# Altium schematic sheet Mode.SchDoc: Наименование
size 420 x 297 mm; ApprovedBy: Утвердил; CheckedBy: Проверил; Author: Разработал; CompanyName: ВлГУ; DrawnBy: Н.Контр; Engineer: Т.Контр; SheetNumber: 2; SheetTotal: 1; PageSetup: Record=PageOptions|CenterHorizontal=True|CenterVertical=True|PrintScale=0.94|XCorrection=1.00|YCorrection=1.00|PrintKind=1|BorderSize=5000000|LeftOffset=0|BottomOffset=0|Orientation=1|PaperLength=1000|PaperWidth=1000|Scale=100|PaperSource=7|PrintQuality=-4|MediaType=1|DitherType=10|PaperKind=A4|PrintScaleMode=1; DecimalNumber: СНАБ.468222.001 ЭЗ; HeadOfSector: Нач. сектора; MainDevice: Перв.примен.; Name: Наименование; DocumentName: Sheet1.SCHDOC
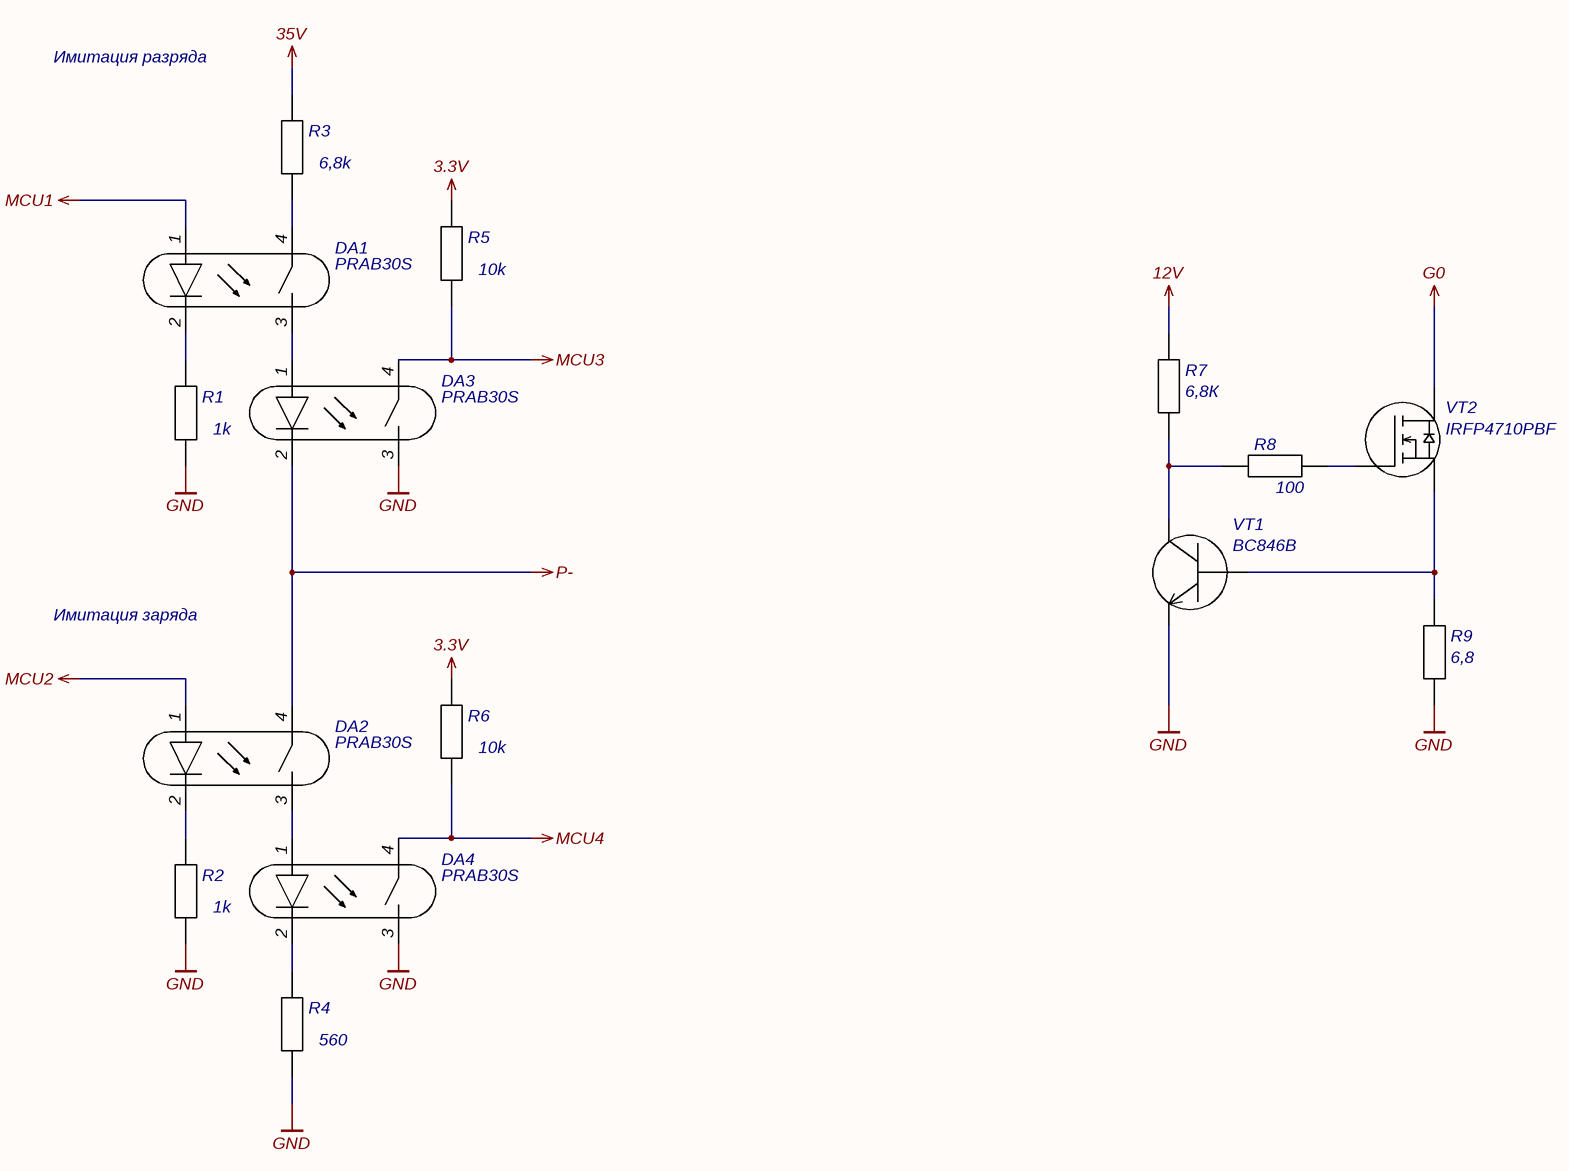
[diagram p0: Mode.SchDoc]

## Parts
DA1  PRAB30S  [SOP-4]
DA2  PRAB30S  [SOP-4]
DA3  PRAB30S  [SOP-4]
DA4  PRAB30S  [SOP-4]
R1  1k  [R0603]
R2  1k  [R0603]
R3  6,8k  [R1206]
R4  560  [R1206]
R5  10k  [R0603]
R6  10k  [R0603]
R7  6,8К  [R1206]
R8  100  [R0603]
R9  6,8  [SQP 5W]
VT1  BC846B  [SOT-23]
VT2  IRFP4710PBF  [TO-247AC]

## Nets
3.3V: R5.2 R6.2
12V: R7.2
35V: R3.2
G0: VT2.2(D)
GND: DA3.3(Out1.2) DA4.3(Out1.2) R1.1 R2.1 R4.1 R9.1 VT1.2(E)
MCU1: DA1.1(A1)
MCU2: DA2.1(A1)
MCU3: DA3.4(Out1.1) R5.1
MCU4: DA4.4(Out1.1) R6.1
P-: DA2.4(Out1.1) DA3.2(K1)
NetDA1_2: DA1.2(K1) R1.2
NetDA1_3: DA1.3(Out1.2) DA3.1(A1)
NetDA1_4: DA1.4(Out1.1) R3.1
NetDA2_2: DA2.2(K1) R2.2
NetDA2_3: DA2.3(Out1.2) DA4.1(A1)
NetDA4_2: DA4.2(K1) R4.2
NetR7_1: R7.1 R8.1 VT1.3(C)
NetR8_2: R8.2 VT2.1(G)
NetR9_2: R9.2 VT1.1(B) VT2.3(S)

## Notes on the sheet
- Имитация разряда
- Имитация заряда
- Подп. и дата
- Инв.№ дубл.
- Взам.инв.№
- Подп.и дата
- Инв.№ подл.
- Изм.
- Лист
- № докум.
- Подп.
- Дата
- Копировал
- Формат  A3

## Library data of the parts
DA1-DA4 = PRAB30S: Реле твердотельное с оптической развязкой; Manufacturer: ОАО «Протон»; Case: SOP-4; Name: PRAB30S; Datasheet: https://static.chipdip.ru/lib/271/DOC000271061.pdf
R1-R8 = Chip Resistor: Чип-резистор
  R1 R2: Value: 1k
  R3: Value: 6,8k
  R4: Value: 560
  R5 R6: Value: 10k
  R7: Value: 6,8К
  R8: Value: 100
R9 = Resistor: Резистор; Value: 6,8
VT1 = BC846B: Транзистор биполярный NPN, 65В; Manufacturer: Nexperia B.V.; Case: SOT-23; Name: BC846B; Datasheet: https://static.chipdip.ru/lib/551/DOC012551042.pdf
VT2 = IRFP4710PBF: Транзистор MOSFET N-канал, 100В; Manufacturer: INFINEON TECHNOLOGIES AG.; Case: TO-247AC; Name: IRFP4710PBF; Datasheet: https://static.chipdip.ru/lib/205/DOC000205410.pdf